# EAGLE design cc2652r (EAGLE 9.6.2)
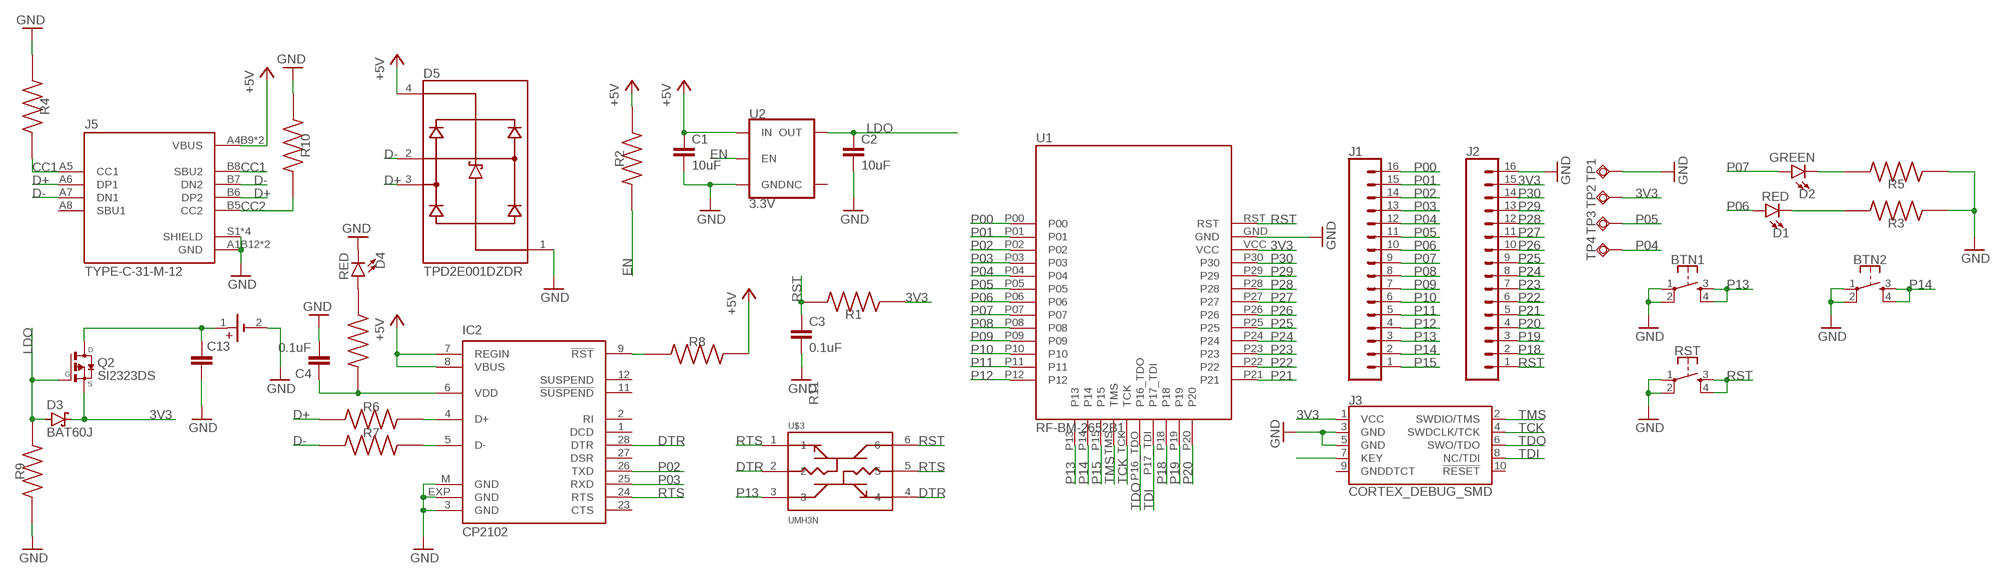
[diagram p0: schematic, sheet 1]

## Parts
BT2  79527141  [79527141]
BTN1  MOMENTARY-SWITCH-SPST-2-SMD-4.6X2.8MM  [TACTILE_SWITCH_SMD_4.6X2.8MM]
BTN2  MOMENTARY-SWITCH-SPST-2-SMD-4.6X2.8MM  [TACTILE_SWITCH_SMD_4.6X2.8MM]
C1  10uF  10UF-0603-6.3V-20%  [0603]
C2  10uF  10UF-0603-6.3V-20%  [0603]
C3  0.1uF  0.1UF-0603-25V-(+80/-20%)  [0603]
C4  0.1uF  0.1UF-0603-25V-(+80/-20%)  [0603]
C13  C_TANTALUM-2917(7343-METRIC)  [CAPM7343X310]
D1  RED  LED-RED0603  [LED-0603]
D2  GREEN  LED-GREEN0603  [LED-0603]
D3  BAT60J  [SOD323_ST]
D4  RED  LED-RED0603  [LED-0603]
D5  TPD2E001DZDR  [SOT192P237X122-4N]
IC2  CP2102  [MLP28]
J1  CONN_161X16_NO_SILK  [1X16_NO_SILK]
J2  CONN_161X16_NO_SILK  [1X16_NO_SILK]
J3  CORTEX_DEBUG_SMD  [SAMTECH_FTSH-105-01]
J5  TYPE-C-31-M-12  [HRO_TYPE-C-31-M-12]
Q2  SI2323DS  [SOT23]
R1  RC0402FR-073M6L  [RESC1005X40N]
R2  RC0402FR-073M6L  [RESC1005X40N]
R3  RC0402FR-073M6L  [RESC1005X40N]
R4  RC0402FR-073M6L  [RESC1005X40N]
R5  RC0402FR-073M6L  [RESC1005X40N]
R6  RC0402FR-073M6L  [RESC1005X40N]
R7  RC0402FR-073M6L  [RESC1005X40N]
R8  RC0402FR-073M6L  [RESC1005X40N]
R9  RC0402FR-073M6L  [RESC1005X40N]
R10  RC0402FR-073M6L  [RESC1005X40N]
R11  RC0402FR-073M6L  [RESC1005X40N]
RST  MOMENTARY-SWITCH-SPST-2-SMD-4.6X2.8MM  [TACTILE_SWITCH_SMD_4.6X2.8MM]
TP1  TPSQTP14R  [TP14R]
TP2  TPSQTP14R  [TP14R]
TP3  TPSQTP14R  [TP14R]
TP4  TPSQTP14R  [TP14R]
U1  RF-BM-2652B1  [RF-BM-2652B1]
U2  3.3V  V_REG_AP2112K-3.3V  [SOT23-5]
U$3  UMH3N  [SOP65P210X100-6N]

## Nets
3V3: D3.C J2.15 J3.1(VCC) Q2.2(S) R1.1 TP2.TP U1.VCC
+5V: C1.1 D5.4(VCC) IC2.7(REGIN) IC2.8(VBUS) J5.A4B9(VBUS) J5.B4A9(VBUS) R2.2 R8.2 U2.1(IN)
CC1: J5.A5(CC1) J5.B8(SBU2) R4.2
CC2: J5.B5(CC2) R10.2
D+: D5.3(IO2) J5.A6(DP1) J5.B6(DP2) R6.1
D-: D5.2(IO1) J5.A7(DN1) J5.B7(DN2) R7.1
DTR: IC2.28(DTR) U$3.2 U$3.4
EN: R2.1 U2.3(EN)
GND: BT2.2(-) BTN1.1 BTN1.2 BTN2.1 BTN2.2 C1.2 C2.2 C3.2 C4.2 C13.2 D4.C D5.1(GND) IC2.3(GND) IC2.EXP(GND) IC2.M(GND) J2.16 J3.3(GND) J3.5(GND) J5.A1B12(GND) J5.B1A12(GND) J5.S1(SHIELD) J5.S2(SHIELD) J5.S3(SHIELD) J5.S4(SHIELD) R3.1 R4.1 R5.1 R9.1 R10.1 RST.1 RST.2 TP1.TP U1.GND U2.2(GND)
LDO: C2.1 D3.A Q2.1(G) R9.2 U2.5(OUT)
N$1: IC2.9(!RST) R8.1
N$2: D1.C R3.2
N$3: D2.C R5.2
N$5: IC2.4(D+) R6.2
N$6: IC2.5(D-) R7.2
N$7: BT2.1(+) C13.1 Q2.3(D)
N$8: D4.A R11.1
N$18: J3.7(KEY)
P00: J1.16 U1.P00
P01: J1.15 U1.P01
P02: IC2.26(TXD) J1.14 U1.P02
P03: IC2.25(RXD) J1.13 U1.P03
P04: J1.12 TP4.TP U1.P04
P05: J1.11 TP3.TP U1.P05
P06: D1.A J1.10 U1.P06
P07: D2.A J1.9 U1.P07
P08: J1.8 U1.P08
P09: J1.7 U1.P09
P10: J1.6 U1.P10
P11: J1.5 U1.P11
P12: J1.4 U1.P12
P13: BTN1.3 BTN1.4 J1.3 U1.P13 U$3.3
P14: BTN2.3 BTN2.4 J1.2 U1.P14
P15: J1.1 U1.P15
P18: J2.2 U1.P18
P19: J2.3 U1.P19
P20: J2.4 U1.P20
P21: J2.5 U1.P21
P22: J2.6 U1.P22
P23: J2.7 U1.P23
P24: J2.8 U1.P24
P25: J2.9 U1.P25
P26: J2.10 U1.P26
P27: J2.11 U1.P27
P28: J2.12 U1.P28
P29: J2.13 U1.P29
P30: J2.14 U1.P30
RST: C3.1 J2.1 R1.2 RST.3 RST.4 U1.RST U$3.6
RTS: IC2.24(RTS) U$3.1 U$3.5
TCK: J3.4(SWDCLK/TCK) U1.TCK
TDI: J3.8(NC/TDI) U1.P17_TDI
TDO: J3.6(SWO/TDO) U1.P16_TDO
TMS: J3.2(SWDIO/TMS) U1.TMS
U3V3: C4.1 IC2.6(VDD) R11.2
Unconnected: IC2.1(DCD) IC2.2(RI) IC2.11(!SUSPEND) IC2.12(SUSPEND) IC2.23(CTS) IC2.27(DSR) J3.9(GNDDTCT) J3.10(!RESET) J5.A8(SBU1) U2.4(NC)

## Library data of the parts
BT2 = Battery Holder_2:79527141: BATTERY HOLDER COIN 20MM SMD Manufacturer's datasheet <https://katalog.we-online.de/em/datasheet/79527141.pdf>; CREATED_BY: PCBLayout.com; DIGIKEY_PART_NO: 732-12325-2-ND; MANUFACTURER: Wurth Electronics Inc.; MPN: 79527141
BTN1 BTN2 RST = SparkFun-Switches:MOMENTARY-SWITCH-SPST-2: Momentary Switch (Pushbutton) - SPST - Two Circuits Normally-open (NO) SPST momentary switches (buttons, pushbuttons). Schematic symbol includes two switch circuits. Variants SMD-4.6MMX2.8MM - 4.60mm x 2.80mm Tactile Momentary Button Switch - Used on SparkFun SAMD21 Mini Breakout <https://www.sparkfun.com/products/13664> SMD-5.2MM - Mini Pushbutton Switch - SMD <https://www.sparkfun.com/products/8720> - Used on Arduino Pro Mini <https://www.sparkfun.com/products/11114>; PROD_ID: SWCH-13065
C1 C2 = SparkFun-Capacitors:10UF: 10.0µF ceramic capacitors A capacitor is a passive two-terminal electrical component used to store electrical energy temporarily in an electric field.; PROD_ID: CAP-11015
C3 C4 = SparkFun-Capacitors:0.1UF: 0.1µF ceramic capacitors A capacitor is a passive two-terminal electrical component used to store electrical energy temporarily in an electric field.; PROD_ID: CAP-00810
C13 = Capacitor:C: Capacitor - Generic; CATEGORY: Capacitor
D1 D4 = SparkFun-LED:LED-RED: Red SMD LED Used in manufacturing of most products at SparkFun Packages: 0603 - SMD 0603 package [Product Link] <http://docs.avagotech.com/docs/AV02-0551EN> 0603 SMART - SMD 0603 SMART package ( more efficient and expensive)[Product Link] <http://www.osram-os.com/Graphics/XPic2/00077099_0.pdf> 1206 - SMD1206 package [Product Link] <https://www.sparkfun.com/datasheets/DevTools/LilyPad/Q150OVS4.pdff> SparkFun Products: Pro Mini 328 -5V <https://www.sparkfun.com/products/821> RedBoard <https://www.sparkfun.com/products/12757> IOIO-OTG <https://www.sparkfun.com/products/13613>; PROD_ID: DIO-00819
D2 = SparkFun-LED:LED-GREEN: Green SMD LED Used in manufacturing of various products at SparkFun Packages: 0603 - SMD 0603 package [Product Link] <http://www.futureelectronics.com/en/technologies/semiconductors/optoelectronics/leds/Pages/9894312-LTST-C190GKT.aspx?CrossPart=HSMG-C190&IM=0> LilyPad 1206 - SMD1206 LilyPad package [Product Link] <http://www.futureelectronics.com/en/Technologies/Product.aspx?ProductID=IN150NGHARVATEKCORPORATION2049943&IM=0> 1206 - SMD1206 package [Product Link] <http://www.futureelectronics.com/en/technologies/semiconductors/optoelectronics/leds/Pages/8315665-LTST-C150KGKT.aspx?IM=0> 1206 Bottom Mount -SMD 1206 Bottom Mount [Product Link] <http://www.digikey.com/product-detail/en/lite-on-inc/LTST-C230KGKT/160-1456-1-ND/386854> SparkFun Products: Pro Mini 328 -5V <https://www.sparkfun.com/products/821> RedBoard <https://www.sparkfun.com/products/12757> MP3 Trigger <https://www.sparkfun.com/products/13720> Makey Makey <https://www.sparkfun.com/products/11076>; PROD_ID: DIO-00821
D3 = diode:BAT60J: Schottky barrier diode Source: www.st.com, BAT60J.pdf
D5 = TPD2E001DZDR:TPD2E001DZDR: Low-capacitance 2-channel +/-15k-V ESD protection array for high-speed data interfaces Check prices <https://pricing.snapeda.com/parts/TPD2E001DZDR/Texas%20Instruments/view-part?ref=eda>; AVAILABILITY: In Stock; DESCRIPTION: Low-capacitance 2-channel +/-15k-V ESD protection array for high-speed data interfaces 4-SOT-23 -40 to 85; MF: Texas Instruments; MP: TPD2E001DZDR; PACKAGE: SOT-23-4 Texas Instruments; PRICE: None; PURCHASE-URL: https://pricing.snapeda.com/search/part/TPD2E001DZDR/?ref=eda
IC2 = silabs:CP210*: Single-Chip USB to UART Bridge Source: www.silabs.com .. CP2101.pdf / cp2102.pdf; MF: FARNELL; MPN: CP2102-GM; OC_FARNELL: 9282130; OC_NEWARK: 30K5635
J1 J2 = SparkFun-Connectors:CONN_16: Multi connection point. Often used as Generic Header-pin footprint for 0.1 inch spaced/style header connections On any of the 0.1 inch spaced packages, you can populate with these: Break Away Headers - Straight <https://www.sparkfun.com/products/116> (PRT-00116) Break Away Male Headers - Right Angle <https://www.sparkfun.com/products/553> (PRT-00553) Female Headers <https://www.sparkfun.com/products/115> (PRT-00115) Break Away Headers - Machine Pin <https://www.sparkfun.com/products/117> (PRT-00117) Break Away Female Headers - Swiss Machine Pin <https://www.sparkfun.com/products/743> (PRT-00743) For SCREWTERMINALS and SPRING TERMINALS visit here: Screw Terimnals on SparkFun.com <https://www.sparkfun.com/search/results?term=Screw+Terminals> (5mm/3.5mm/2.54mm spacing) This device is also useful as a general connection point to wire up your design to another part of your project. Our various solder wires solder well into these plated through hole pads. Hook-Up Wire - Assortment (Stranded, 22 AWG) <https://www.sparkfun.com/products/11375> (PRT-11375) Hook-Up Wire - Assortment (Solid Core, 22 AWG) <https://www.sparkfun.com/products/11367> (PRT-11367) View the entire wire category on our website here <https://www.sparkfun.com/categories/141> Special notes: Molex polarized connector foot print use with SKU : PRT-08231 with associated crimp pins and housings. 1MM SMD Version SKU: PRT-10208 NOTES ON THE VARIANTS LOCK and LOCK_LONGPADS... This footprint was designed to help hold the alignment of a through-hole component (i.e. 6-pin header) while soldering it into place. You may notice that each hole has been shifted either up or down by 0.005 of an inch from it's more standard position (which is a perfectly straight line). This slight alteration caused the pins (the squares in the middle) to touch the edges of the holes. Because they are alternating, it causes a "brace" to hold the component in place. 0.005 has proven to be the perfect amount of "off-center" position when using our standard breakaway headers. Although looks a little odd when you look at the bare footprint, once you have a header in there, the alteration is very hard to notice. Also,if you push a header all the way into place, it is covered up entirely on the bottom side.
J3 = SparkFun-Connectors:CORTEX_DEBUG: Cortex Debug Connector - 10 pin Supports JTAG debug, Serial Wire debug, and Serial Wire Viewer. PTH and SMD connector options available. General Connector Information <http://infocenter.arm.com/help/topic/com.arm.doc.faqs/attached/13634/cortex_debug_connectors.pdf> Products: PTH Connector <http://www.digikey.com/product-detail/en/cnc-tech/3220-10-0100-00/1175-1627-ND/3883661> -via Digi-Key SparkFun PSoc <https://www.sparkfun.com/products/13229> SparkFun T <https://www.sparkfun.com/products/13810>
J5 = TYPE-C-31-M-12:TYPE-C-31-M-12: USB Connectors 24 Receptacle 1 8.94*7.3mm RoHS; AVAILABILITY: Unavailable; DESCRIPTION: USB Connectors 24 Receptacle 1 8.94*7.3mm RoHS; MF: HRO Electronics Co., Ltd.; MP: TYPE-C-31-M-12; PACKAGE: Package; PRICE: None
Q2 = SI2323DS:SI2323DS: P-Channel MOSFET; AVAILABILITY: Unavailable; DESCRIPTION: P-Channel 20V 3.7A (Ta) 750mW (Ta) Surface Mount SOT-23-3 (TO-236); MF: Vishay Siliconix; MP: SI2323DS; PACKAGE: SOT-23-3 Vishay Siliconix; PRICE: None
R1-R11 = RC0402FR-073M6L:RC0402FR-073M6L: RESISTOR, 0402 0.063W 1% 3M6; Resistance:3.6Mohm; Resistance Tolerance:± 1%; Power Rating:0.063W; Voltage Rating:50V; Series:RC32H; Temperature Coefficient:± 100ppm/°C; Resistor Element Type:Thick Film; Resistor Case Style:0402; No. of Pins:2; SVHC:No SVHC; Case Style:0402; External Length / Height:1mm; Temperature Coeff. +:100ppm/°C; Temperature Coeff. -:100ppm/°C; External Depth:0.35mm; External Width:0.5mm; Operating Temperature Range:-55°C to +155°C; Overload Voltage:100V Check prices <https://pricing.snapeda.com/parts/RC0402FR-073M6L/Yageo/view-part?ref=eda>; AVAILABILITY: Good; DESCRIPTION: RESISTOR, 0402 0.063W 1% 3M6; Resistance:3.6Mohm; Resistance Tolerance:± 1%; Power Rating:0.063W; Voltage Rating:50V; Series:RC32H; Temperature Coefficient:± 100ppm/°C; Resistor Element Type:Thick Film; Resistor Case Style:0402; No. of Pins:2; SVHC:No SVHC; Case Style:0402; External Length / Height:1mm; Temperature Coeff. +:100ppm/°C; Temperature Coeff. -:100ppm/°C; External Depth:0.35mm; External Width:0.5mm; Operating Temperature Range:-55°C to +155°C; Overload Voltage:100V; MF: Yageo; MP: RC0402FR-073M6L; PACKAGE: 1005 Panasonic Electronic Components; PRICE: None; PURCHASE-URL: https://pricing.snapeda.com/search/part/RC0402FR-073M6L/?ref=eda
TP1-TP4 = testpad:TPSQ: Test pad
U1 = rb-bm-2652b1:RF-BM-2652B1
U2 = SparkFun-IC-Power:V_REG_AP2112: AP2112 - 600mA CMOS LDO Regulator w/ Enable The AP2112 is CMOS process low dropout linear regulator with enable function, the regulator delivers a guaranteed 600mA (min.) continuous load current. Features Output Voltage Accuracy: ±1.5% Output Current: 600mA (Min.) Foldback Short Current Protection: 50mA Enable Function to Turn ON/OFF VOUT Low Dropout Voltage (3.3V): 250mV (Typ.) @IOUT=600mA Excellent Load Regulation: 0.2%/A (Typ.) Excellent Line Regulation: 0.02%/V (Typ.) Low Quiescent Current: 55μA (Typ.) Low Standby Current: 0.01μA (Typ.) Low Output Noise: 50μVRMS PSRR: 100Hz -65dB, 1kHz -65dB OTSD Protection Stable with 1.0μF Flexible Cap: Ceramic, Tantalum and Aluminum Electrolytic Operation Temperature Range: -40°C to 85°C ESD: MM 400V, HBM 4000V; PROD_ID: VREG-12457
U$3 = UMH3N:UMH3N: Dual PNP/NPN transistor for chip reset; AVAILABILITY: Unavailable; DESCRIPTION: Pre-Biased Bipolar Transistor (BJT) 2 NPN - Pre-Biased (Dual) 50V 100mA 250MHz 150mW Surface Mount UMT6; MF: Rohm; MP: UMH3N; PACKAGE: SOT-363 Rohm; PRICE: None

## Board
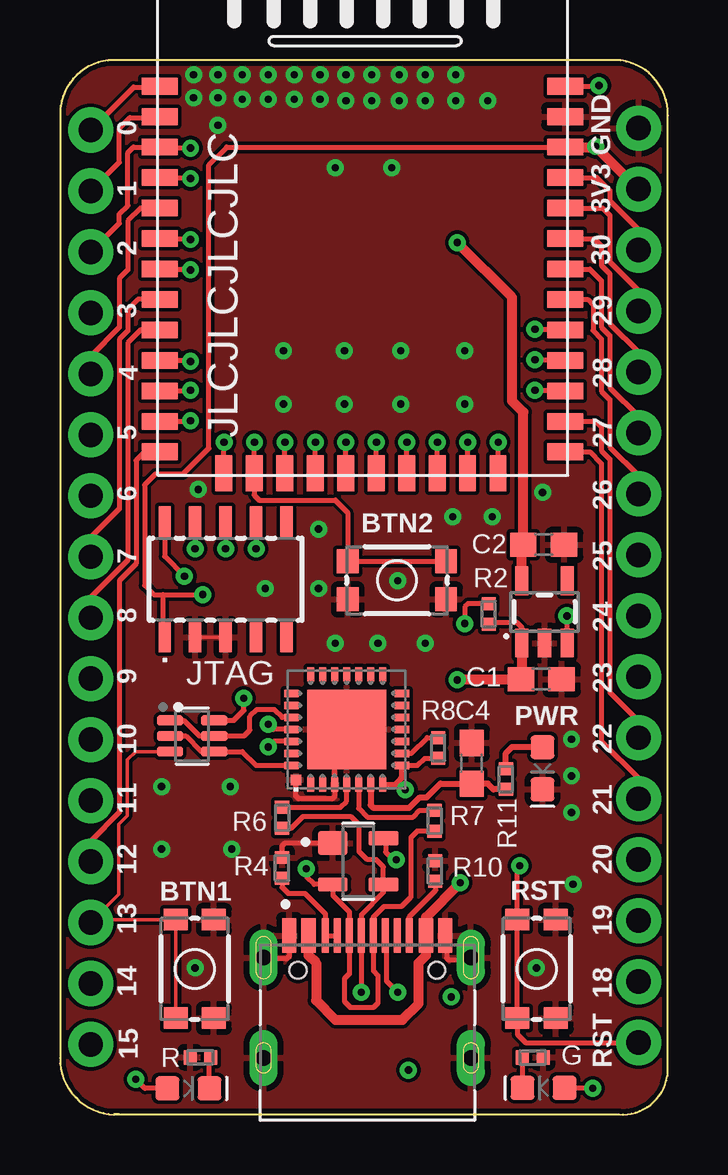
[diagram p1: board, top side]
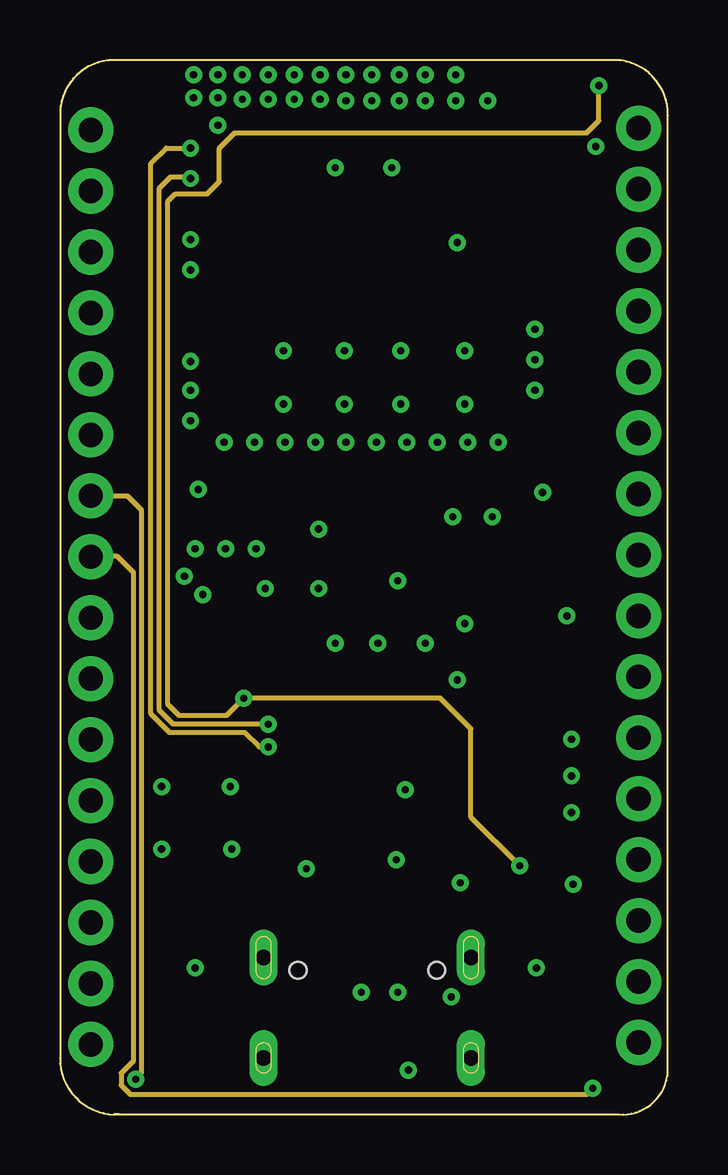
[diagram p2: board, inner layer Route2]
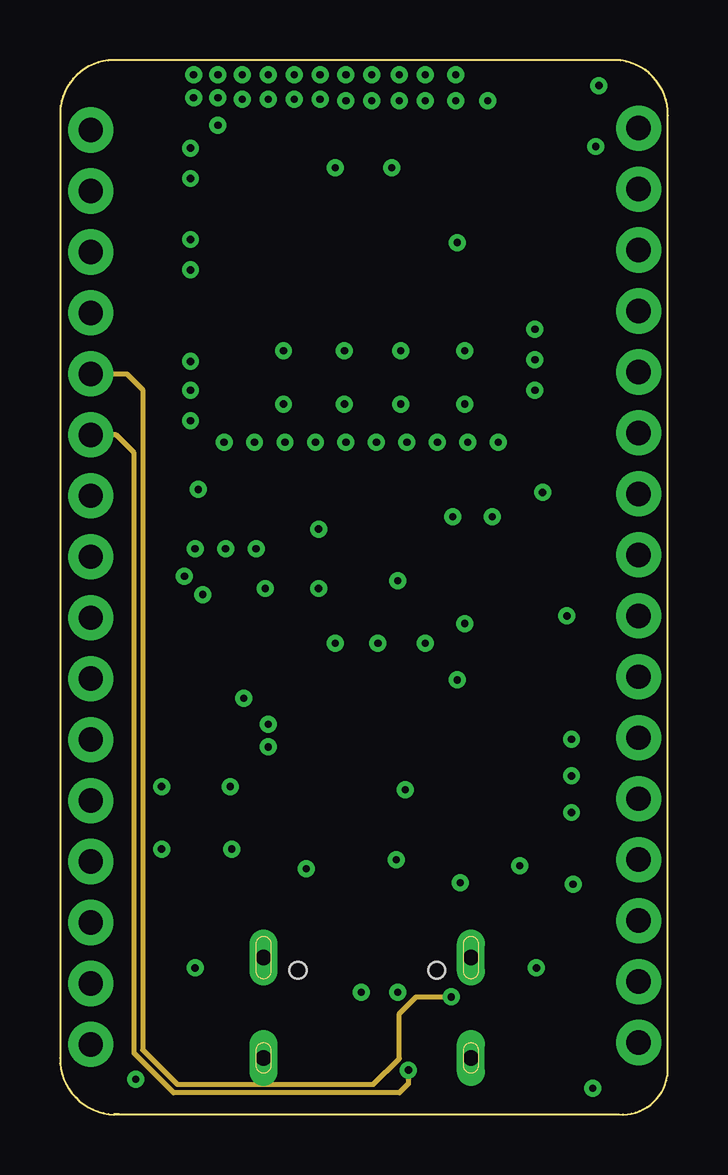
[diagram p3: board, inner layer Route15]
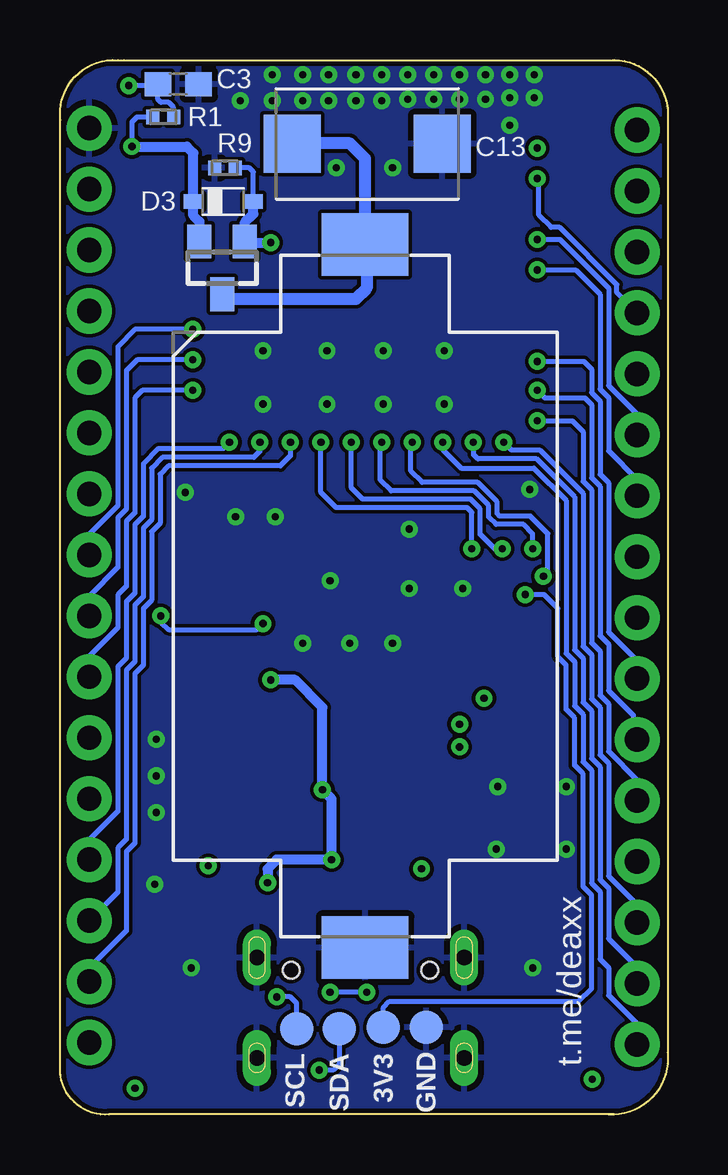
[diagram p4: board, bottom side, seen from below]

Size 25.33 x 43.94 mm. Coordinates in mm from the lower left corner, seen from the top.
Outline: 0.01,41.93 0.01,2.58 arc100 2.48,0 2.24,0.01 23.3,0.01 23.46,0 arc80 25.3,1.6 25.31,1.67 25.31,41.43 25.33,41.63 arc95 22.92,43.93 22.66,43.93 2.29,43.93 2.22,43.94 arc80 0.03,42.03 0.01,41.93
Copper layers (1+2*15+16): Top 0.035mm / dielectric 0.2mm / Route2 0.035mm / dielectric 0.15mm / Route15 0.035mm / dielectric 0.2mm / Bottom 0.035mm
Design rules "default *": minimum track width 0.15mm, minimum drill 0.3mm, track to track 6mil, track to pad 6mil, pad to pad 6mil, via to via 6mil, smd to smd 6mil, copper to edge 0.2mm, drill to drill 0.3mm, minimum pad ring 10mil, minimum via ring 8mil, stop-mask expansion 4mil, vias tented up to drill 0.3mm, thermal gap 10mil

### Footprints (pad centres in the part's own frame; a part is rotated, then mirrored left to right if it is on the bottom)
79527141 = smd 2.6 x 3.6: 1 -14.65,0; 2 14.65,0
TACTILE_SWITCH_SMD_4.6X2.8MM = smd 0.9 x 1: 1 -2.05,-0.8; 2 2.05,-0.8; 3 2.05,0.8; 4 -2.05,0.8
0603 = smd 1.1 x 1: 1 -0.85,0; 2 0.85,0
CAPM7343X310 = smd 2.368 x 2.404: 1 -3.121,0; 2 3.121,0
LED-0603 = smd 1 x 1: A -0.877,0; C 0.877,0
SOD323_ST = smd 0.8 x 0.6: A 1.25,0; C -1.25,0
SOT192P237X122-4N = smd 1.24 x 0.99: 1 -1.055,0.76 | smd 1.24 x 0.59: 2 -1.055,-0.96; 3 1.055,-0.96; 4 1.055,0.96
MLP28 = smd 0.6 x 0.3: 1 -2.3,1.5; 2 -2.3,1; 3 -2.3,0.5; 4 -2.3,0; 5 -2.3,-0.5; 6 -2.3,-1; 7 -2.3,-1.5; 15 2.3,-1.5; 16 2.3,-1; 17 2.3,-0.5; 18 2.3,0; 19 2.3,0.5; 20 2.3,1; 21 2.3,1.5 | smd 0.3 x 0.6: 8 -1.5,-2.3; 9 -1,-2.3; 10 -0.5,-2.3; 11 0,-2.3; 12 0.5,-2.3; 13 1,-2.3; 14 1.5,-2.3; 22 1.5,2.3; 23 1,2.3; 24 0.5,2.3; 25 0,2.3; 26 -0.5,2.3; 27 -1,2.3; 28 -1.5,2.3 | smd 3.3 x 3.3: EXP 0,0 | smd 0.435 x 0.435: M -2.103,2.103
1X16_NO_SILK = drill 1.016 pad 1.88: 1 0,0; 2 2.54,0; 3 5.08,0; 4 7.62,0; 5 10.16,0; 6 12.7,0; 7 15.24,0; 8 17.78,0; 9 20.32,0; 10 22.86,0; 11 25.4,0; 12 27.94,0; 13 30.48,0; 14 33.02,0; 15 35.56,0; 16 38.1,0
SAMTECH_FTSH-105-01 = smd 0.508 x 1.27: 1 -2.54,-2.413; 2 -2.54,2.413; 3 -1.27,-2.413; 4 -1.27,2.413; 5 0,-2.413; 6 0,2.413; 7 1.27,-2.413; 8 1.27,2.413; 9 2.54,-2.413; 10 2.54,2.413
HRO_TYPE-C-31-M-12 = smd 0.6 x 1.45: A1B12 -3.25,5.095; A4B9 -2.45,5.095; B1A12 3.25,5.095; B4A9 2.45,5.095 | smd 0.3 x 1.45: A5 -1.25,5.095; A6 -0.25,5.095; A7 0.25,5.095; A8 1.25,5.095; B5 1.75,5.095; B6 0.75,5.095; B7 -0.75,5.095; B8 -1.75,5.095 | drill 0.65 pad 1.05 long: S1 -4.32,4.18; S2 4.32,4.18; S3 -4.32,0; S4 4.32,0 | hole 0.7: -2.89,3.65; 2.89,3.65
SOT23 = smd 1 x 1.4: 1 -0.95,-1.1; 2 0.95,-1.1; 3 0,1.1
RESC1005X40N = smd 0.54 x 0.6: 1 -0.432,0; 2 0.432,0
TP14R = smd 1.4 x 1.4: TP 0,0
RF-BM-2652B1 = smd 1.5 x 0.7: GND 16.97,14.947; P00 0.079,16.216; P01 0.079,14.947; P02 0.079,13.677; P03 0.079,12.406; P04 0.079,11.136; P05 0.079,9.867; P06 0.079,8.597; P07 0.079,7.327; P08 0.079,6.056; P09 0.079,4.787; P10 0.079,3.517; P11 0.079,2.247; P12 0.079,0.977; P21 16.97,0.977; P22 16.97,2.247; P23 16.97,3.517; P24 16.97,4.787; P25 16.97,6.056; P26 16.97,7.327; P27 16.97,8.597; P28 16.97,9.867; P29 16.97,11.136; P30 16.97,12.406; RST 16.97,16.216; VCC 16.97,13.677 | smd 0.7 x 1.5: P13 2.746,0.087; P14 4.016,0.087; P15 5.286,0.087; P16_TDO 9.096,0.087; P17_TDI 10.366,0.087; P18 11.636,0.087; P19 12.906,0.087; P20 14.176,0.087; TCK 7.826,0.087; TMS 6.556,0.087
SOT23-5 = smd 0.55 x 1.2: 1 -0.95,-1.3; 2 0,-1.3; 3 0.95,-1.3; 4 0.95,1.3; 5 -0.95,1.3
SOP65P210X100-6N = smd 1.09 x 0.4: 1 -0.92,0.65; 2 -0.92,0; 3 -0.92,-0.65; 4 0.92,-0.65; 5 0.92,0; 6 0.92,0.65

### Placement (x,y rotation side)
BT2  12.61,21.6 270 bottom
BTN1  5.61,6.07 90 top
BTN2  14.04,22.26 0 top
C1  20.05,18.14 0 top
C2  20.15,23.74 0 top
C3  20.4,42.93 0 bottom
C4  17.16,14.63 90 top
C13  12.52,40.45 0 bottom
D1  5.35,1.09 0 top
D2  20.15,1.11 180 top
D3  18.52,38.05 0 bottom
D4  20.11,14.43 270 top
D5  12.42,10.55 0 top
IC2  11.94,16.05 90 top
J1  1.28,2.92 90 top
J2  24.11,3 90 top
J3  6.9,22.3 0 top
J5  12.8,2.36 0 top
Q2  18.57,35.28 180 bottom
R1  21.02,41.56 0 bottom
R2  17.86,20.86 270 top
R3  5.85,2.38 0 top
R4  9.25,10.28 270 top
R5  19.7,2.38 180 top
R6  9.26,12.37 90 top
R7  15.6,12.24 90 top
R8  15.76,15.28 270 top
R9  18.46,39.45 0 bottom
R10  15.63,10.15 270 top
R11  18.58,13.98 270 top
RST  19.86,6.07 90 top
TP1  10.07,3.63 0 bottom
TP2  11.85,3.63 0 bottom
TP3  13.69,3.57 0 bottom
TP4  15.47,3.57 0 bottom
U1  4.08,26.63 0 top
U2  20.19,20.95 0 top
U$3  5.5,15.77 0 top

### Tracks (layer width: path | path; a pad name or v marks a point on that pad's centre or on a via)
3V3  (via drill 0.3)
  Top 0.2: U1.VCC 6.94,40.31 6.2,39.57 6.2,27.76 5.12,26.68 3.98,26.68 3.53,26.23 3.53,22.05 3.91,21.67 4.3,21.67 | 4.3,21.67 v5.95,21.67 | J3.1 4.3,19.95 4.3,21.67
  Top 0.406: J2.15 v22.33,40.33 22.31,40.31 U1.VCC
  Bottom 0.2: v22.33,40.33 22.33,41.35 22.12,41.56 R1.1 | TP2.TP 11.85,4.46 11.6,4.71 3.72,4.71 3.18,5.26 3.18,9.15 3.53,9.5 3.53,14.19 3.88,14.54 3.88,16.53 4.23,16.88 4.23,18.72 4.59,19.07 4.59,21.09 5.16,21.67 v5.95,21.67
  Bottom 0.406: v22.33,40.33 20.04,40.33 19.77,40.06 D3.C 19.77,37.46 19.52,37.21 Q2.2
+5V  (via drill 0.3)
  Top 0.2: 14.27,14.55 IC2.8 14.89,14.55 15.19,14.84 R8.2 | D5.4 13.57,11.42 13.57,10.93 13.88,10.62 v14.01,10.62 | R2.2 17.96,20.52 19.03,20.52 19.24,20.31 U2.1
  Top 0.254: IC2.7 13.97,13.75 14.11,13.89 | 14.27,14.55 14.27,14.05 14.11,13.89 | 14.11,13.89 14.11,13.82 v14.39,13.54
  Top 0.406: U2.1 19.24,18.17 C1.1 19.18,18.11 v16.55,18.11 | J5.A4B9 10.35,6.64 10.67,6.32 10.67,4.75 11.47,3.95 14.27,3.95 14.94,4.63 14.94,6.32 15.25,6.64 J5.B4A9 15.25,8.23 16.68,9.65 v16.68,9.66
  Bottom 0.406: v16.68,9.66 16.68,10.24 16.3,10.62 v14.01,10.62 14.01,13.16 v14.39,13.54 14.39,16.97 15.53,18.11 v16.55,18.11
CC1
  Top 0.2: J5.A5 J5.B8 11.05,8.37 10.2,9.22 9.5,9.22 9.25,9.47 R4.2
CC2
  Top 0.2: J5.B5 14.55,8.24 15.66,9.35 15.66,9.69 R10.2
D+  (via drill 0.3)
  Top 0.2: R6.1 9.64,11.93 10.13,12.43 12.11,12.43 12.46,12.08 12.46,10.96 12.8,10.62 13.19,10.62 13.48,10.32 D5.3 13.48,9.26 12.55,8.33 J5.A6 v12.55,5.1 v12.55,5.09 | J5.B6 13.6,7.41 13.6,5.57 v14.07,5.09
  Bottom 0.2: v12.55,5.09 v14.07,5.09
D-  (via drill 0.3)
  Top 0.2: v10.26,10.24 10.26,9.92 10.59,9.59 D5.2 11.37,9.13 12.05,8.45 J5.B7 12.05,5.87 11.85,5.66 11.85,4.71 12.11,4.46 13.06,4.46 13.25,4.65 13.25,5.79 13.05,5.99 J5.A7 13.05,8.23 13.5,8.68 14.24,8.68 14.62,9.06 14.62,11.54 14.88,11.81 R7.1
DTR
  Top 0.2: IC2.28 8.18,14.55 7.6,15.12 U$3.4 5.88,15.12 5.23,15.77 U$3.2
EN  (via drill 0.3)
  Top 0.2: U2.3 21.14,20.76 v21.12,20.78 | R2.1 17,21.29 16.87,21.16 v16.87,20.46
  Bottom 0.2: v21.12,20.78 21.12,20.52 20.81,20.2 17.12,20.2 v16.87,20.46
GND  (via drill 0.3)
  Top 0.152: J3.3 J3.5
  Top 0.2: IC2.M 9.82,13.92 9.82,13.28 9.95,13.16 11.34,13.16 11.44,13.26 IC2.3 11.44,15.15 11.41,15.19 11.41,15.51 IC2.EXP | R4.1 9.25,11.19 9.38,11.32 D5.1 | J5.B1A12 16.11,7.4 16.11,6.52 16.18,6.44 17.02,6.44 J5.S2 | J5.A1B12 9.55,6.6 9.44,6.49 8.54,6.49 J5.S1
  other vias: 5.57,43.32 6.58,43.32 7.6,43.32 8.68,43.32 9.76,43.32 10.84,43.32 11.92,43.32 12.99,43.32 14.14,43.32 15.22,43.32 16.49,43.32 4.23,13.66 4.23,11.06 11.47,19.63 13.25,19.63 15.22,19.63 16.36,24.9 18.01,24.9 9.31,29.6 9.31,31.83 11.85,31.83 14.2,31.83 16.87,31.83 11.85,29.6 14.2,29.6 16.87,29.6 7.09,13.66 7.15,11.06 8.55,21.92 10.77,24.4 10.77,21.92 21.31,15.63 21.31,14.11 21.31,12.59 8.68,42.3 7.6,42.3 6.58,42.37 5.57,42.37 9.76,42.3 10.84,42.3 11.92,42.24 12.99,42.24 14.14,42.24 15.22,42.24 16.49,42.24 17.82,42.24 5.76,26.05 20.11,25.92 6.58,41.22 13.82,39.45 11.47,39.45 19.85,6.11 21.38,9.6 5.63,6.11 14.07,22.24
  pour Top: -0.19,44.06 -0.19,-0.33 25.71,-0.33 25.71,44.06
  pour Bottom: -0.39,44.13 -0.39,-0.24 25.51,-0.24 25.51,44.13
LDO  (via drill 0.3)
  Top 0.406: U2.5 19.24,23.68 C2.1 19.3,29.26 18.84,29.73 18.84,34.05 v16.55,36.33
  Bottom 0.2: D3.A 17.27,39.28 17.44,39.45 R9.2
  Bottom 0.406: v16.55,36.33 17.57,36.33 Q2.1 17.62,37.17 17.27,37.52 D3.A
N$1
  Top 0.2: IC2.9 14.63,15.05 15.29,15.71 R8.1
N$2
  Top 0.2: D1.C 6.23,2.33 R3.2
N$3
  Top 0.2: D2.C 19.27,2.37 R5.2
N$5
  Top 0.2: IC2.4 11.94,13.06 11.68,12.8 R6.2
N$6
  Top 0.2: IC2.5 12.44,12.75 12.8,12.39 14.71,12.39 14.98,12.67 R7.2
N$7
  Bottom 0.508: C13.1 15.63,40.46 13.25,40.46 12.61,39.83 BT2.1 12.55,36.19 12.55,34.43 13,33.98 18.38,33.98 Q2.3
N$8
  Top 0.254: R11.1 18.58,15.06 18.84,15.32 20.09,15.32 D4.A
P00
  Top 0.2: J1.16 3.07,42.81 4.12,42.81 U1.P00
P01
  Top 0.2: J1.15 2.47,39.67 2.47,41.1 2.92,41.54 4.12,41.54 U1.P01
P02  (via drill 0.3)
  Top 0.2: IC2.26 8.91,15.55 v8.68,15.32 | v5.44,40.27 4.2,40.27 U1.P02 3.05,40.31 2.82,40.08 2.82,37.88 2.47,37.52 2.47,37.13 J1.14
  Route2 0.2: v8.68,15.32 8.3,15.32 7.7,15.92 4.57,15.92 3.79,16.69 3.79,39.64 4.42,40.27 v5.44,40.27
P03  (via drill 0.3)
  Top 0.2: IC2.25 8.9,16.05 v8.68,16.27 | U1.P03 5.4,39.04 v5.44,39
  Route2 0.2: v8.68,16.27 4.71,16.27 4.14,16.84 4.14,38.59 4.61,39.06 5.37,39.06 v5.44,39
  Bottom 0.2: J1.13 2.12,34.24 2.12,34.57 4.51,36.97 4.87,36.97 5.37,37.48 5.37,38.94 v5.44,39
P04  (via drill 0.3)
  Top 0.2: U1.P04 3.36,37.77 2.82,37.23 2.82,35.19 2.47,34.84 2.47,32.8 1.28,31.6 J1.12
  Route15 0.2: J1.12 2.78,30.86 3.44,30.2 3.44,2.7 4.89,1.25 13.06,1.25 14.14,2.33 14.14,4.2 14.84,4.9 v16.3,4.9
  Bottom 0.2: TP4.TP 15.47,4.65 15.73,4.9 v16.3,4.9
P05  (via drill 0.3)
  Top 0.2: U1.P05 5.4,36.5 v5.44,36.46
  Route15 0.2: v14.52,1.85 14.52,1.28 14.14,0.9 4.74,0.9 3.09,2.55 3.09,27.57 2.34,28.32 J1.11
  Bottom 0.2: v5.44,36.46 4.5,36.46 2.47,34.43 2.47,30.37 1.28,29.18 J1.11 | TP3.TP 13.69,2.11 13.95,1.85 v14.52,1.85
P06  (via drill 0.3)
  Top 0.2: U1.P06 5.4,35.23 v5.44,35.19 | D1.A 3.53,1.09 v3.15,1.47
  Route2 0.2: J1.10 2.8,25.78 3.41,25.18 3.41,1.73 v3.15,1.47
  Bottom 0.2: v5.44,35.19 3.84,35.19 2.82,34.18 2.82,30.22 2.47,29.87 2.47,27.65 1.28,26.46 J1.10
P07  (via drill 0.3)
  Top 0.2: U1.P07 3.25,33.96 2.82,33.54 2.82,32.65 2.47,32.3 2.47,25.24 1.28,24.05 J1.9 | D2.A 22.18,1.11 v22.2,1.09
  Route2 0.2: J1.9 1.29,23.25 2.39,23.25 3.05,22.59 3.05,2.23 2.55,1.72 2.55,1.22 2.93,0.84 21.95,0.84 v22.2,1.09
P08
  Top 0.2: U1.P08 3.36,32.69 2.82,32.15 2.82,23.1 1.28,21.56 J1.8
P09  (via drill 0.3)
  Top 0.2: U1.P09 5.4,31.42 v5.44,31.38
  Bottom 0.2: v5.44,31.38 3.49,31.38 3.18,31.06 3.18,30.08 2.82,29.72 2.82,26.67 2.47,26.32 2.47,20.1 1.28,18.9 J1.7
P10  (via drill 0.3)
  Top 0.2: U1.P10 5.41,30.15 v5.44,30.17
  Bottom 0.2: v5.44,30.17 5.12,29.86 3.46,29.86 3.18,29.58 3.18,26.53 2.82,26.17 2.82,19.95 2.47,19.6 2.47,17.67 1.44,16.63 1.44,15.78 J1.6
P11  (via drill 0.3)
  Top 0.2: U1.P11 5.41,28.88 v5.44,28.9
  Bottom 0.2: v5.44,28.9 3.97,28.9 3.53,28.46 3.53,26.38 3.18,26.03 3.18,19.66 2.82,19.31 2.82,17.46 2.47,17.11 2.47,15.13 1.28,13.94 J1.5
P12
  Top 0.2: U1.P12 3.53,27.61 3.18,27.25 3.18,22.95 2.47,22.25 2.47,12.59 1.28,11.4 J1.4
P13  (via drill 0.3)
  Top 0.152: U$3.3 3.15,15.12 2.8,14.77 2.8,12.45 2.45,12.1 2.45,9.17 J1.3 1.4,8.12 BTN1.3 BTN1.4
  Top 0.2: U1.P13 6.82,28 v6.84,28.02
  Bottom 0.2: v6.84,28.02 6.52,27.7 5.35,27.7 3.53,25.88 3.53,19.51 3.18,19.16 3.18,17.32 2.82,16.97 2.82,14.98 2.47,14.63 2.47,9.94 1.28,8.74 J1.3
P14  (via drill 0.3)
  Top 0.2: v8.11,28.02 8.09,28 U1.P14 8.09,25.81 8.3,25.6 11.47,25.6 11.99,25.08 BTN2.4 BTN2.3
  Bottom 0.2: v8.11,28.02 8.11,27.51 7.92,27.32 5.46,27.32 3.88,25.73 3.88,19.37 3.53,19.01 3.53,17.17 3.18,16.82 3.18,14.84 2.82,14.48 2.82,9.79 2.47,9.44 2.47,7.33 1.28,6.14 J1.2
P15  (via drill 0.3)
  Top 0.2: U1.P15 9.36,28 v9.38,28.02
  Bottom 0.2: v9.38,28.02 9.38,27.7 8.61,26.94 5.58,26.94 4.23,25.59 4.23,19.22 3.88,18.87 3.88,17.03 3.53,16.67 3.53,14.69 3.18,14.34 3.18,9.64 2.82,9.29 2.82,6.48 2.47,6.13 2.47,4.97 1.28,3.78 J1.1
P18  (via drill 0.3)
  Top 0.2: U1.P18 15.71,28 v15.73,28.02
  Bottom 0.2: v15.73,28.02 15.73,27.44 16.14,27.03 20.81,27.03 21.15,26.68 21.15,24.64 21.51,24.28 21.51,21.43 21.86,21.08 21.86,18.73 22.21,18.37 22.21,11.31 22.56,10.95 22.56,7.65 24.11,6.11 J2.2
P19  (via drill 0.3)
  Top 0.2: U1.P19 16.98,28 v17,28.02
  Bottom 0.2: v17,28.02 17,27.63 17.25,27.38 21.06,27.38 21.51,26.93 21.51,24.78 21.86,24.43 21.86,21.58 22.21,21.22 22.21,18.87 22.56,18.52 22.56,11.46 22.92,11.11 22.92,9.27 J2.3
P20  (via drill 0.3)
  Top 0.2: U1.P20 18.25,28 v18.27,28.02
  Bottom 0.2: v18.27,28.02 18.52,27.76 21.22,27.76 21.86,27.13 21.86,24.93 22.21,24.58 22.21,21.72 22.56,21.37 22.56,19.02 22.92,18.67 22.92,12.63 24.11,11.44 J2.4
P21
  Top 0.2: U1.P21 22.08,27.61 22.56,27.13 22.56,15.56 24.11,14.01 J2.5
P22
  Top 0.2: U1.P22 22.33,28.88 22.56,28.65 22.56,27.66 22.92,27.31 22.92,17.59 24.11,16.4 J2.6
P23  (via drill 0.3)
  Top 0.2: U1.P23 19.81,30.15 v19.79,30.17
  Bottom 0.2: v19.79,30.17 21.89,30.17 22.21,29.86 22.21,25.07 22.56,24.72 22.56,22 22.92,21.65 22.92,20.29 24.11,19.09 J2.7
P24  (via drill 0.3)
  Top 0.2: U1.P24 19.81,31.42 v19.79,31.44
  Bottom 0.2: v19.79,31.44 22.12,31.44 22.56,31 22.56,25.22 22.92,24.87 22.92,22.79 24.11,21.6 J2.8
P25  (via drill 0.3)
  Top 0.2: U1.P25 19.81,32.69 v19.79,32.71
  Bottom 0.2: v19.79,32.71 22.2,32.71 22.92,32 22.92,25.37 24.11,24.17 J2.9
P26
  Top 0.2: U1.P26 21.98,33.96 22.21,33.73 22.21,32.66 22.56,32.31 22.56,30.14 22.92,29.79 22.92,27.81 24.11,26.62 J2.10
P27
  Top 0.2: U1.P27 22.08,35.23 22.56,34.75 22.56,32.81 22.92,32.46 22.92,30.29 24.11,29.09 J2.11
P28
  Top 0.2: U1.P28 22.27,36.5 22.56,36.21 22.56,35.38 22.92,35.03 22.92,32.95 24.11,31.76 J2.12
P29
  Top 0.2: U1.P29 22.61,37.77 22.92,37.46 22.92,35.53 24.11,34.33 J2.13
P30
  Top 0.2: U1.P30 22.37,39.04 22.92,38.49 22.92,38.07 24.11,36.87 J2.14
RST  (via drill 0.3)
  Top 0.2: U$3.6 7.25,16.42 7.66,16.84 v7.66,17.35 | U1.RST 22.43,42.85 v22.46,42.87 | v19.15,10.36 19.06,10.27 RST.3 RST.4 19.06,3.34 19.4,3 J2.1
  Route2 0.2: v19.15,10.36 17.12,12.39 17.12,16.08 15.85,17.35 v7.66,17.35 6.93,16.62 4.97,16.62 4.49,17.09 4.49,38.05 4.8,38.37 6.14,38.37 6.65,38.87 6.65,40.27 7.28,40.91 21.95,40.91 22.46,41.41 v22.46,42.87
  Bottom 0.2: R1.2 20.59,41.96 20.81,42.18 21.12,42.18 21.25,42.3 C3.1 21.3,42.87 v22.46,42.87
RTS
  Top 0.2: IC2.24 9.25,16.55 8.93,16.87 8.2,16.87 7.92,16.59 7.92,16.01 7.67,15.77 U$3.5 5.81,15.77 5.16,16.42 U$3.1
TCK  (via drill 0.3)
  Top 0.2: J3.4 v5.63,23.57 | U1.TCK 11.9,28 v11.92,28.02
  Bottom 0.2: v5.63,23.57 5.63,24.21 6.01,24.59 7.15,24.59 7.46,24.9 7.46,25.39 8.07,25.99 11.53,25.99 11.98,26.43 11.98,27.95 v11.92,28.02
TDI  (via drill 0.3)
  Top 0.2: U1.P17_TDI 14.44,28 v14.46,28.02 | J3.8 v8.17,23.57
  Bottom 0.2: v8.17,23.57 8.17,25.09 8.36,25.29 13.82,25.29 14.46,25.92 v14.46,28.02
TDO  (via drill 0.3)
  Top 0.2: U1.P16_TDO 13.17,28 v13.19,28.02 | J3.6 v6.9,23.57
  Bottom 0.2: v13.19,28.02 13.19,26.11 12.71,25.64 8.21,25.64 7.82,25.24 7.82,24.17 7.22,23.57 v6.9,23.57
TMS  (via drill 0.3)
  Top 0.2: v5.18,22.43 4.36,23.25 J3.2 | U1.TMS 10.63,28 v10.65,28.02
  Bottom 0.2: v5.18,22.43 4.99,22.62 4.99,24.21 5.73,24.94 7.01,24.94 7.11,25.04 7.11,25.53 7.92,26.34 10.24,26.34 10.71,26.81 10.71,27.95 v10.65,28.02
U3V3
  Top 0.254: IC2.6 12.94,12.89 13.06,12.77 14.55,12.77 15,13.22 15.28,13.22 15.84,13.78 C4.1 17.83,13.78 18.06,13.55 R11.2
  Top 0.406: C4.1 17.21,13.73

### Text on the board
tNames: 0 | GND | 1 | 3V3 | 2 | 30 | 3 | 29 | 4 | 28 | 5 | JLCJLCJLCJLC | 27 | 6 | 26 | 7 | 25 | 8 | 24 | . | 9 | JTAG | 23 | PWR | 10 | 22 | . | 11 | 21 | 12 | 20 | 13 | 19 | 14 | 18 | 15 | G | R | RST
bNames: GND | 3V3 | SDA | SCL | t.me/deaxx